# Altium schematic sheet 001_top.SchDoc: Overview BAS Main Hub
size A2; Organization: Greenfield Tech Solutions; Address1: Molendreef 33; Address2: Ossendrecht; Address3: 4641CS; Address4: The Netherlands; SheetNumber: 1; SheetTotal: 4
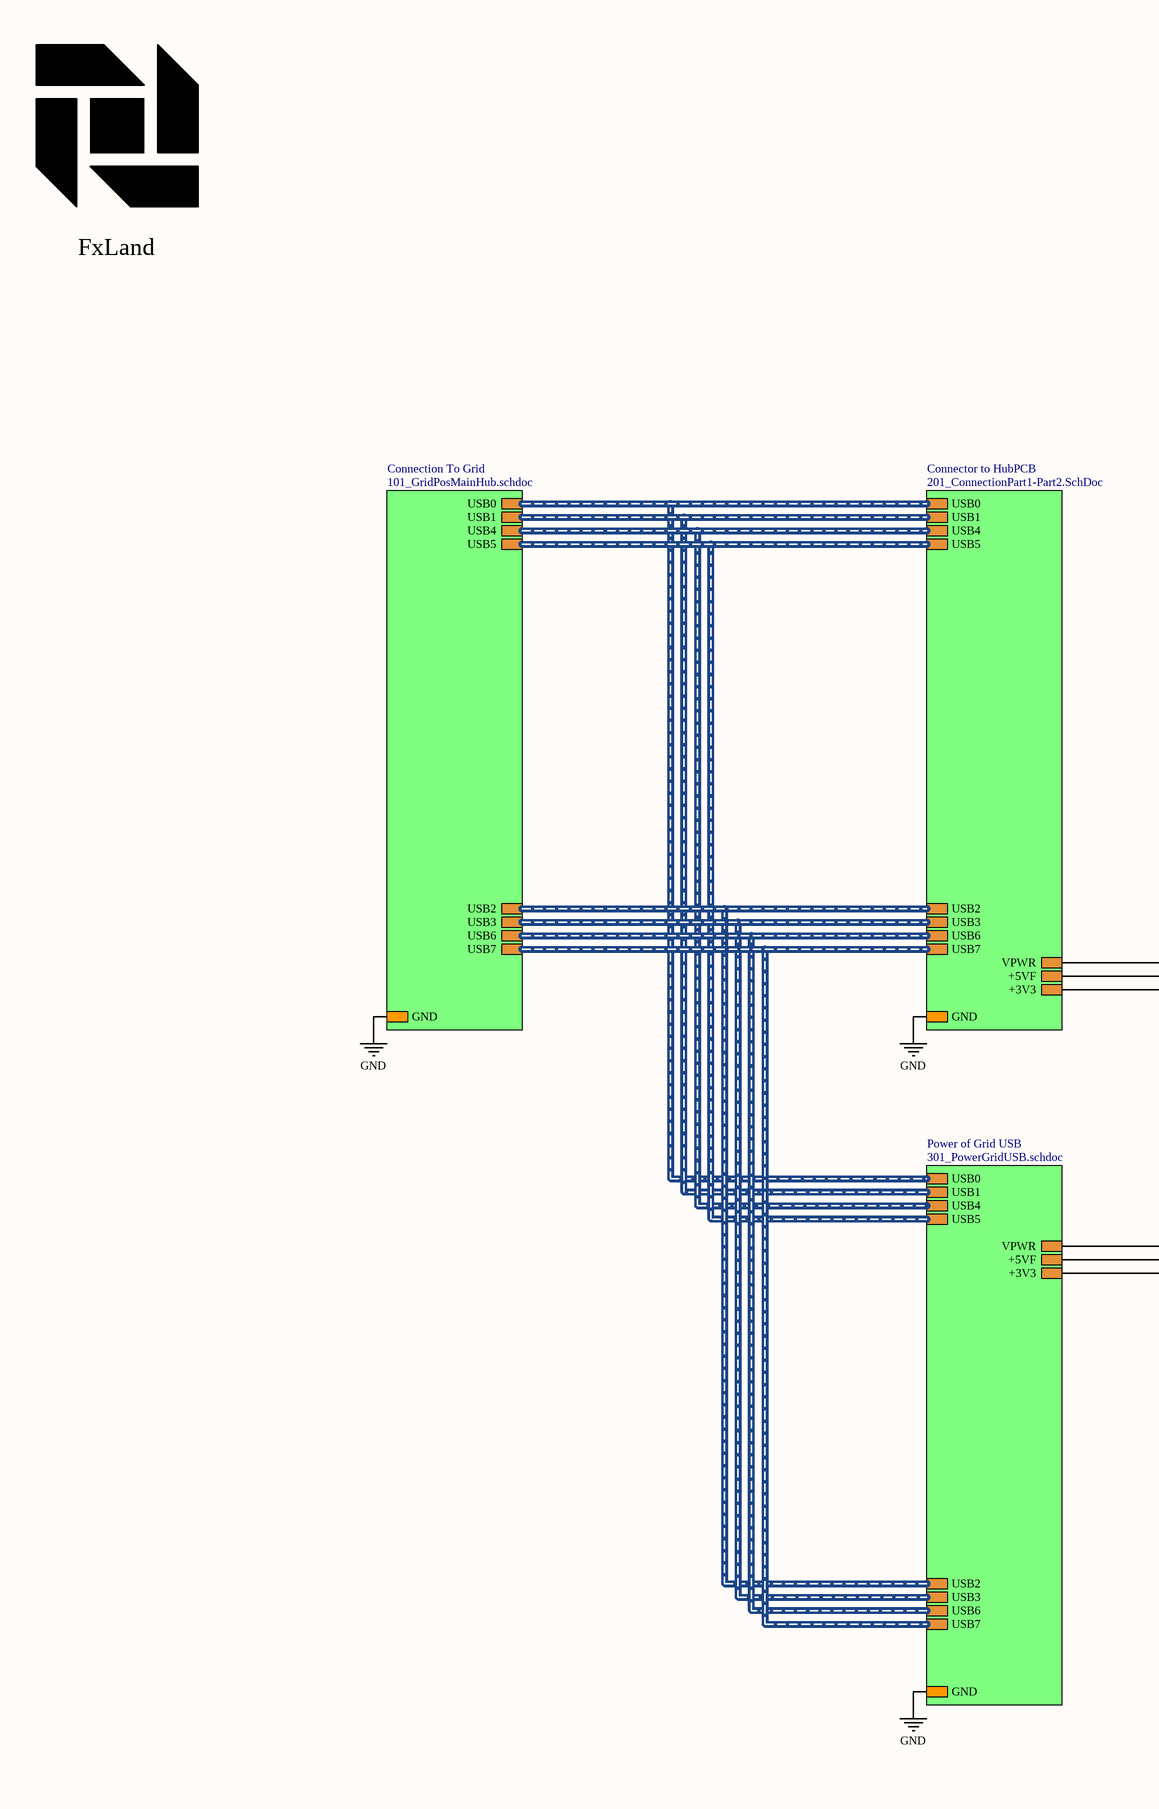
[diagram p0: 001_top.SchDoc, left]
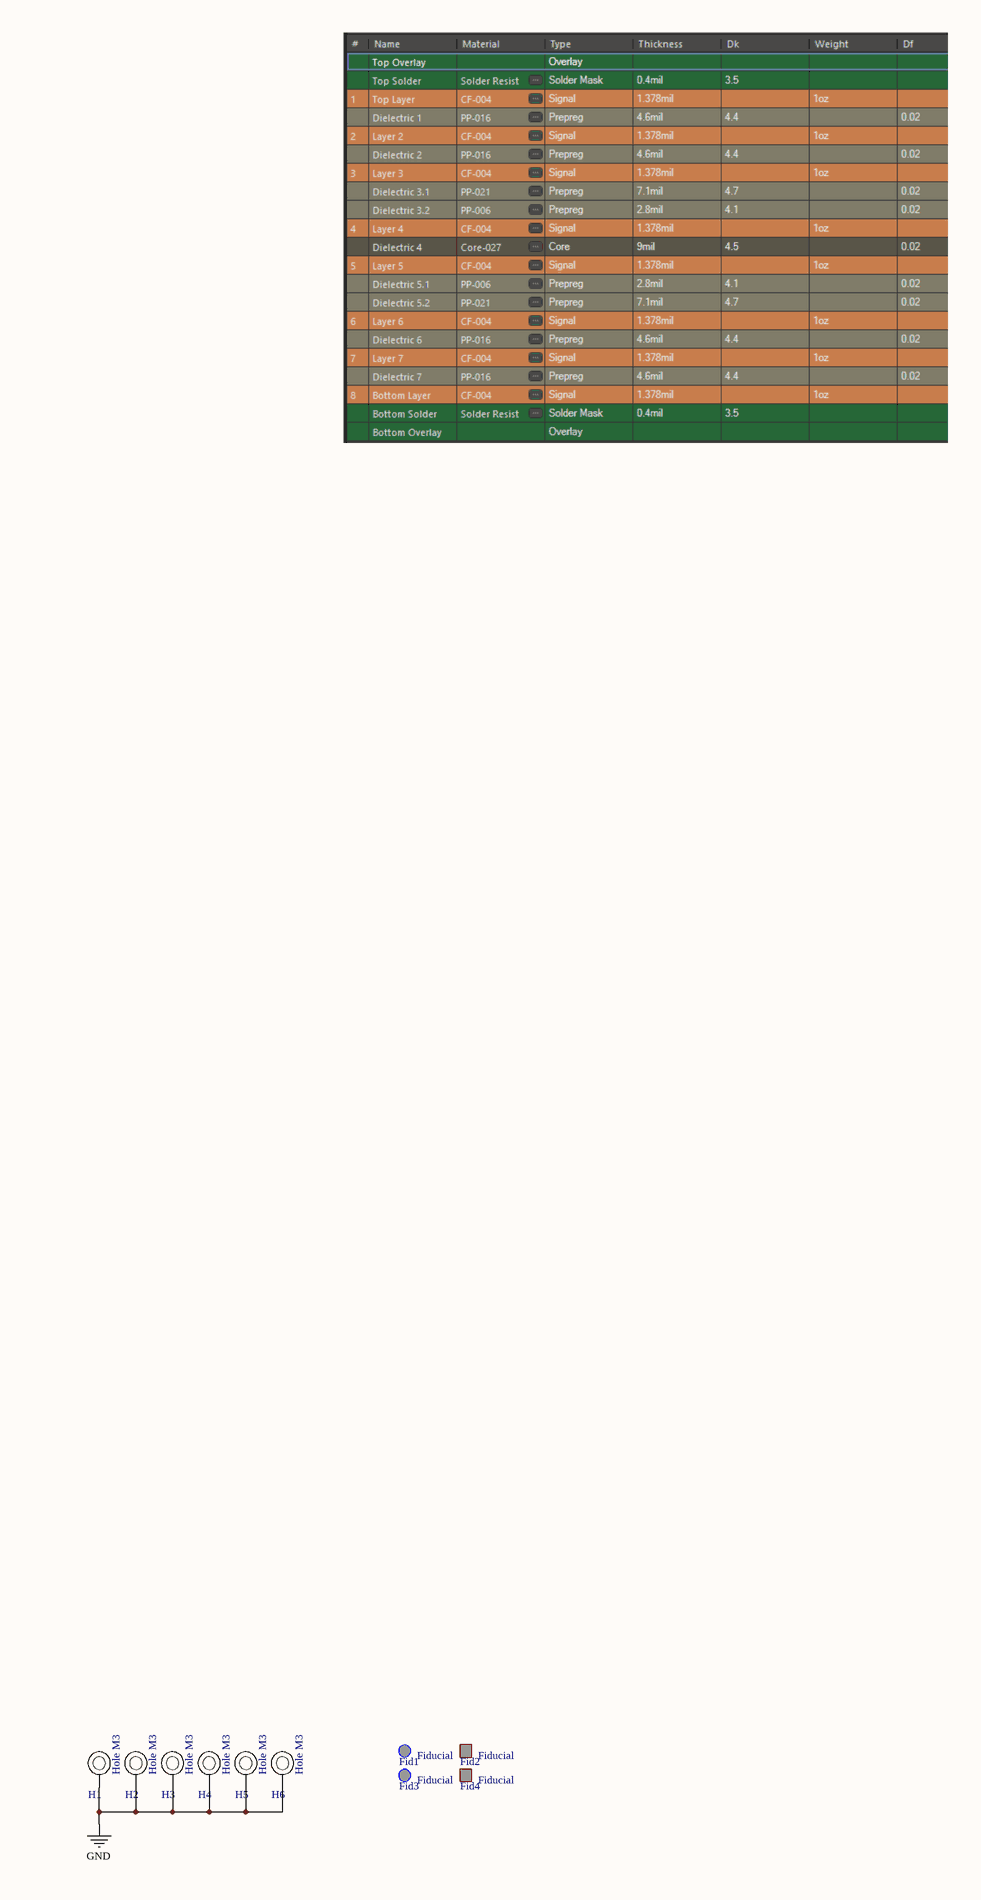
[diagram p1: 001_top.SchDoc, right]

## Parts
Fid1  Fiducial  [FidR_1.0mm]
Fid2  Fiducial  [FidS_1.0mm]
Fid3  Fiducial  [FidR_1.0mm]
Fid4  Fiducial  [FidS_1.0mm]
H1  Hole M3  [HOLE_M3]
H2  Hole M3  [HOLE_M3]
H3  Hole M3  [HOLE_M3]
H4  Hole M3  [HOLE_M3]
H5  Hole M3  [HOLE_M3]
H6  Hole M3  [HOLE_M3]
Logo_FxLand1  FxLand  [Logo_FxLand_3]  (value not drawn)

## Sub-sheets
Connection To Grid = 101_GridPosMainHub.schdoc: GND, USB0, USB1, USB4, USB5, USB2, USB3, USB6, USB7
Connector to HubPCB = 201_ConnectionPart1-Part2.SchDoc: GND, USB0, USB1, USB4, USB5, USB2, USB3, USB6, USB7, VPWR, +5VF, +3V3
Power of Grid USB = 301_PowerGridUSB.schdoc: GND, USB0, USB1, USB4, USB5, USB2, USB3, USB6, USB7, VPWR, +5VF, +3V3

## Nets
GND: H1.1 H2.1 H3.1 H4.1 H5.1 H6.1 ; sheet Connection To Grid/GND, sheet Connector to HubPCB/GND, sheet Power of Grid USB/GND
(unnamed): sheet Connector to HubPCB/VPWR, sheet Power of Grid USB/VPWR
(unnamed): sheet Connector to HubPCB/+5VF, sheet Power of Grid USB/+5VF
(unnamed): sheet Connector to HubPCB/+3V3, sheet Power of Grid USB/+3V3

## Buses and harness runs
harness sheet Connection To Grid/USB0 = sheet Connector to HubPCB/USB0 = sheet Power of Grid USB/USB0
harness sheet Connection To Grid/USB1 = sheet Connector to HubPCB/USB1 = sheet Power of Grid USB/USB1
harness sheet Connection To Grid/USB2 = sheet Connector to HubPCB/USB2 = sheet Power of Grid USB/USB2
harness sheet Connection To Grid/USB3 = sheet Connector to HubPCB/USB3 = sheet Power of Grid USB/USB3
harness sheet Connection To Grid/USB4 = sheet Connector to HubPCB/USB4 = sheet Power of Grid USB/USB4
harness sheet Connection To Grid/USB5 = sheet Connector to HubPCB/USB5 = sheet Power of Grid USB/USB5
harness sheet Connection To Grid/USB6 = sheet Connector to HubPCB/USB6 = sheet Power of Grid USB/USB6
harness sheet Connection To Grid/USB7 = sheet Connector to HubPCB/USB7 = sheet Power of Grid USB/USB7

## Notes on the sheet
- Title
- Size:
- Date:
- File:
- A2
- Number:
- Time:
- Revision:
- Sheet
- of

## Library data of the parts
Fid1 Fid3 = ME0011: Fiducial Round 1mm; Part Number: ME0011; ID: 11; RefVal: Fiducial
Fid2 Fid4 = ME0012: Fiducial Sqaure 1mm; Part Number: ME0012; ID: 12; RefVal: Fiducial
H1-H6 = ME0001: Mounting Hole M3; Part Number: ME0001; ID: 1; RefVal: Hole M3
Logo_FxLand1 = ME0008: Logo FxLand 3; Part Number: ME0008; ID: 8; RefVal: FxLand